# Altium schematic sheet MEM.SchDoc: uSDR schematic
size Letter; Author: Ye-sheng Kuo; CompanyName: Univ. of Michigan; Revision: 2.0; SheetNumber: 15; SheetTotal: 16
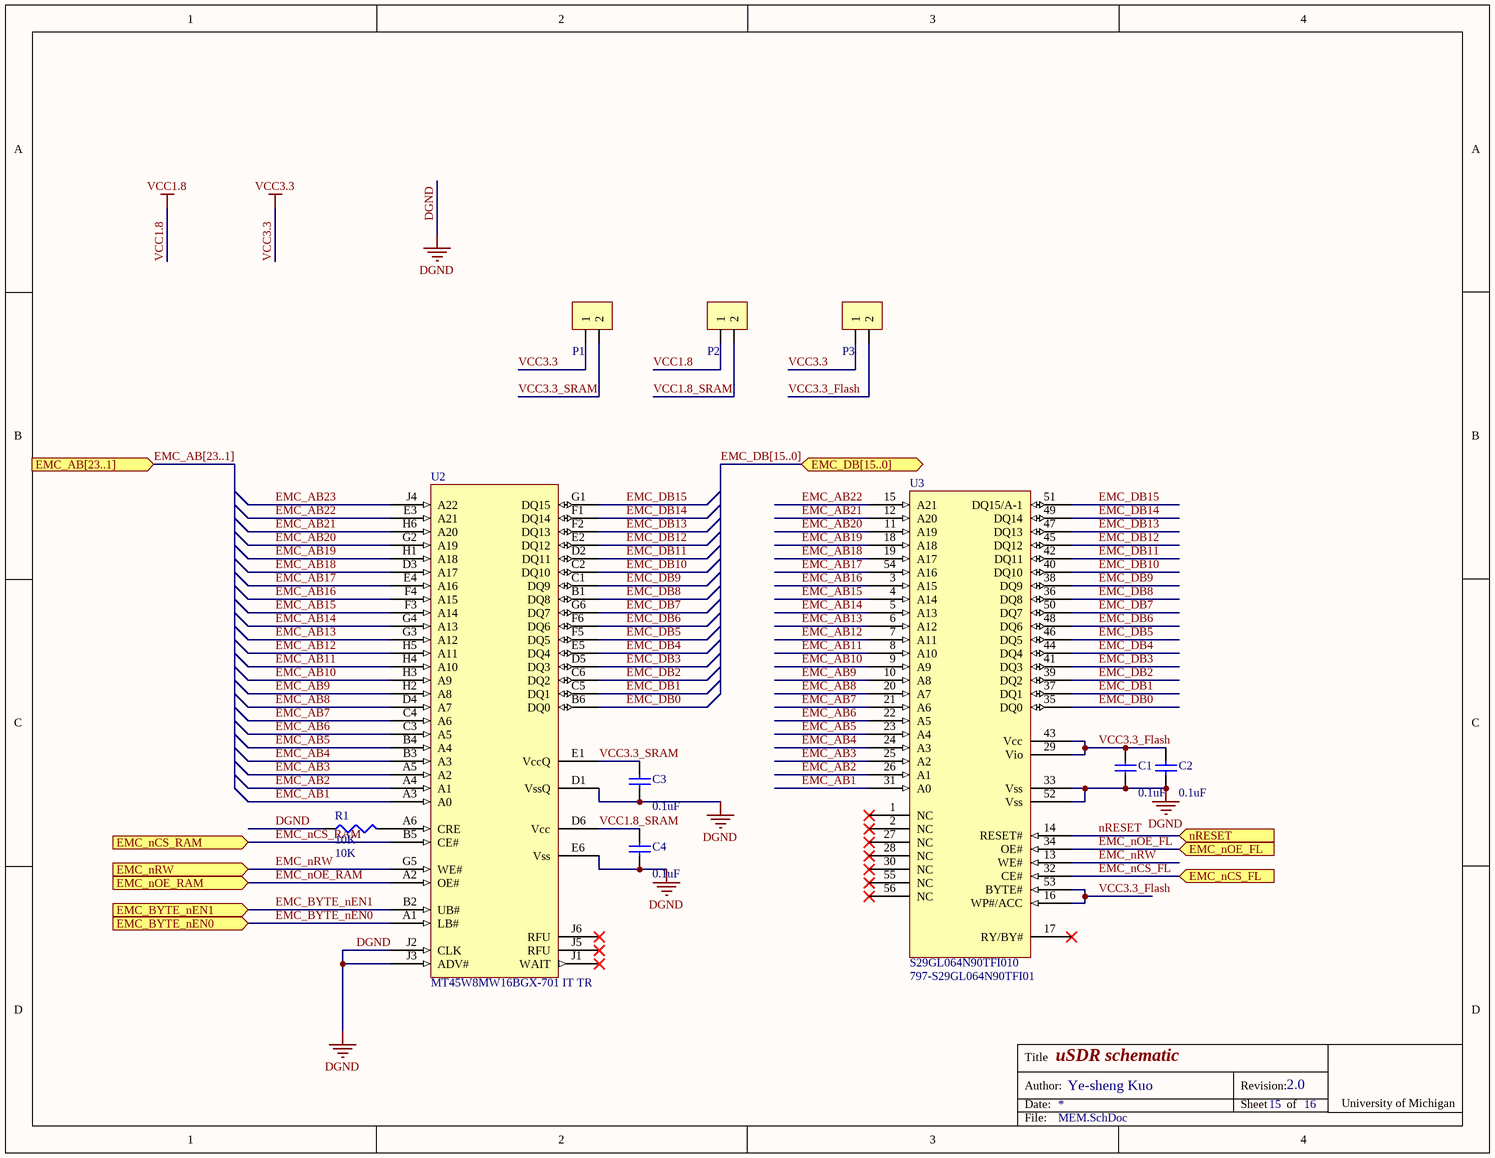
[diagram p0: MEM.SchDoc]

## Parts
C1  0.1uF  [0402]
C2  0.1uF  [0402]
C3  0.1uF  [0402]
C4  0.1uF  [0402]
P1  1 x 2 header  [1x2 header]  (value not drawn)
P2  1 x 2 header  [1x2 header]  (value not drawn)
P3  1 x 2 header  [1x2 header]  (value not drawn)
R1  10K  [0402]
U2  MT45W8MW16BGX-701 IT TR  [BGA54C75P9X6_1000X800X70]
U3  S29GL064N90TFI010  Supplier Part Number 1: 797-S29GL064N90TFI01  [TSSOP50P2000X120-56N]

## Ports
EMC_AB[23..1] (in), EMC_BYTE_nEN0 (in), EMC_BYTE_nEN1 (in), EMC_DB[15..0] (bidir), EMC_nCS_FL (in), EMC_nCS_RAM (in), EMC_nOE_FL (in), EMC_nOE_RAM (in), EMC_nRW (in), nRESET (in)

## Nets
DGND: C1.1 C2.1 C3.1 C4.1 R1.1 U2.D1(VssQ) U2.E6(Vss) U2.J2(CLK) U2.J3(ADV#) U3.33(Vss) U3.52(Vss)
VCC1.8: P2.1
VCC3.3: P1.1 P3.1
EMC_AB1: U2.A3(A0) U3.31(A0)
EMC_AB2: U2.A4(A1) U3.26(A1)
EMC_AB3: U2.A5(A2) U3.25(A2)
EMC_AB4: U2.B3(A3) U3.24(A3)
EMC_AB5: U2.B4(A4) U3.23(A4)
EMC_AB6: U2.C3(A5) U3.22(A5)
EMC_AB7: U2.C4(A6) U3.21(A6)
EMC_AB8: U2.D4(A7) U3.20(A7)
EMC_AB9: U2.H2(A8) U3.10(A8)
EMC_AB10: U2.H3(A9) U3.9(A9)
EMC_AB11: U2.H4(A10) U3.8(A10)
EMC_AB12: U2.H5(A11) U3.7(A11)
EMC_AB13: U2.G3(A12) U3.6(A12)
EMC_AB14: U2.G4(A13) U3.5(A13)
EMC_AB15: U2.F3(A14) U3.4(A14)
EMC_AB16: U2.F4(A15) U3.3(A15)
EMC_AB17: U2.E4(A16) U3.54(A16)
EMC_AB18: U2.D3(A17) U3.19(A17)
EMC_AB19: U2.H1(A18) U3.18(A18)
EMC_AB20: U2.G2(A19) U3.11(A19)
EMC_AB21: U2.H6(A20) U3.12(A20)
EMC_AB22: U2.E3(A21) U3.15(A21)
EMC_AB23: U2.J4(A22)
EMC_BYTE_nEN0: U2.A1(LB#) ; port EMC_BYTE_nEN0
EMC_BYTE_nEN1: U2.B2(UB#) ; port EMC_BYTE_nEN1
EMC_DB0: U2.B6(DQ0) U3.35(DQ0)
EMC_DB1: U2.C5(DQ1) U3.37(DQ1)
EMC_DB2: U2.C6(DQ2) U3.39(DQ2)
EMC_DB3: U2.D5(DQ3) U3.41(DQ3)
EMC_DB4: U2.E5(DQ4) U3.44(DQ4)
EMC_DB5: U2.F5(DQ5) U3.46(DQ5)
EMC_DB6: U2.F6(DQ6) U3.48(DQ6)
EMC_DB7: U2.G6(DQ7) U3.50(DQ7)
EMC_DB8: U2.B1(DQ8) U3.36(DQ8)
EMC_DB9: U2.C1(DQ9) U3.38(DQ9)
EMC_DB10: U2.C2(DQ10) U3.40(DQ10)
EMC_DB11: U2.D2(DQ11) U3.42(DQ11)
EMC_DB12: U2.E2(DQ12) U3.45(DQ12)
EMC_DB13: U2.F2(DQ13) U3.47(DQ13)
EMC_DB14: U2.F1(DQ14) U3.49(DQ14)
EMC_DB15: U2.G1(DQ15) U3.51(DQ15/A-1)
EMC_nCS_FL: U3.32(CE#) ; port EMC_nCS_FL
EMC_nCS_RAM: U2.B5(CE#) ; port EMC_nCS_RAM
EMC_nOE_FL: U3.34(OE#) ; port EMC_nOE_FL
EMC_nOE_RAM: U2.A2(OE#) ; port EMC_nOE_RAM
EMC_nRW: U2.G5(WE#) U3.13(WE#) ; port EMC_nRW
nRESET: U3.14(RESET#) ; port nRESET
VCC1.8_SRAM: C4.2 P2.2 U2.D6(Vcc)
VCC3.3_Flash: C1.2 C2.2 P3.2 U3.16(WP#/ACC) U3.29(Vio) U3.43(Vcc) U3.53(BYTE#)
VCC3.3_SRAM: C3.2 P1.2 U2.E1(VccQ)
NetR1_2: R1.2 U2.A6(CRE)

Not connected (* = marked no-connect by the designer): U2 J1(WAIT)* J5(RFU)* J6(RFU)*; U3 1(NC)* 2(NC)* 17(RY/BY#)* 27(NC)* 28(NC)* 30(NC)* 55(NC)* 56(NC)*

## Buses and harness runs
bus EMC_AB[23..1] = port EMC_AB[23..1]
bus EMC_DB[15..0] = port EMC_DB[15..0]

## Notes on the sheet
- Title
- Date:
- Author:
- Revision:
- Sheet
- of
- University of Michigan
- File:

## Library data of the parts
C1-C4 = Cap Semi: Capacitor (Semiconductor SIM Model); Published: 8-Jun-2000; LatestRevisionDate: 29-May-2009; LatestRevisionNote: IPC-7351 Footprint Added.; PackageReference: C1206; Publisher: Altium Limited; PackageDescription: Chip Capacitor; Value: 0.1uF
P1-P3 = 1 x 2 header: 100 mils standard header
R1 = Res3: Resistor; Published: 8-Jun-2000; LatestRevisionDate: 29-May-2009; LatestRevisionNote: IPC-7351 Footprint Added.; PackageReference: J1-0603; Publisher: Altium Limited; PackageDescription: Chip Resistor; Value: 10K
U2 = MT45W8MW16BGX-701 IT: IC PSRAM 128MBIT 70NS 54VFBGA; Supplier 1: Digi-Key; Supplier Part Number 1: 557-1444-1-ND
U3 = S29GL064N: Flash 3V 64Mb Float Gate highest address 90s; Supplier 1: Mouser